# EasyEDA Pro project ProPrj_picoballoon-tracker-v2_2025-12-21.epro, board PCB5
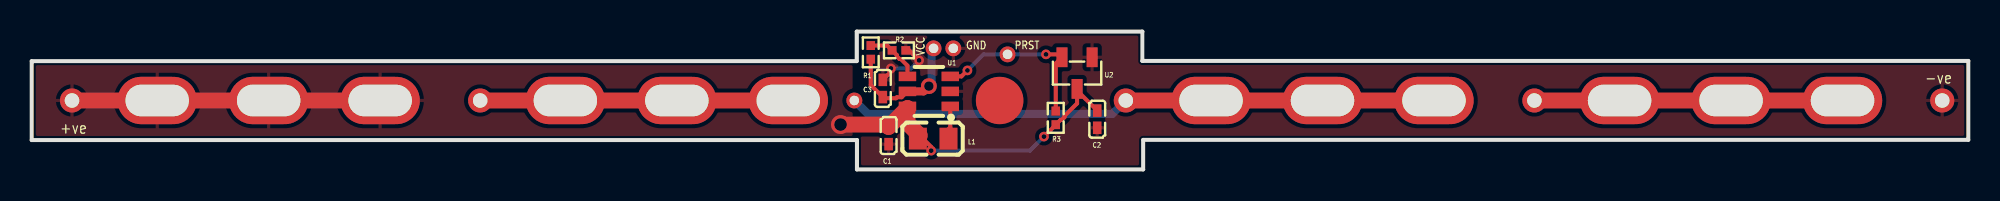
[diagram p5: board, top side]
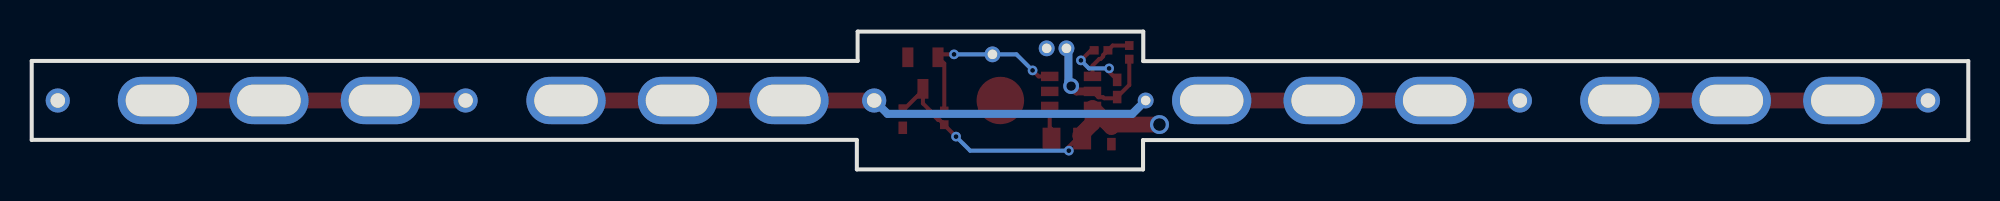
[diagram p6: board, bottom side, seen from below]

Outline 122.11 x 8.73 mm; copper layers: Top Layer, Bottom Layer. Coordinates in mm from the lower left corner of the outline.
Outline path: 0,6.86 52.02,6.86 52.02,8.73 70.03,8.73 70.03,6.87 122.11,6.87 122.11,1.87 70.08,1.87 70.08,0 52.04,0 52.04,1.86 0,1.86 0,6.86
Stack: Top Layer 0.035mm / Dielectric1 0.71mm FR4 er 4.5 / Bottom Layer 0.035mm

## Design rules (mm)
template: JLCPCB Capability(Two Layers Board)
spacing copperThickness1oz (default): track to track 0.102, other pairs 0.152 to 0.3
spacing copperThickness2oz: track to track 0.203, other pairs 0.152 to 0.3
track width copperThickness1oz (default): min 0.127, default 0.254, max 2.54
track width copperThickness2oz: min 0.203, default 0.254, max 2.54
differential pair differentialPair (default): width min 0.127, default 0.254, max 2.54; gap min 0.152, default 0.152
via viaSize (default): diameter min 0.5, default 0.61, max 10; hole min 0.3, default 0.305, max 6.3

## Placement (name value [footprint] x y rotation side)
C1  4.7uF  [C0402]  54.03 2.15 90 top
C2  100nF  [C0402]  67.19 3.18 270 top
C3  10uF  [C0402]  53.67 5.13 270 top
L1  4.7uH  [L0805]  56.84 1.95 0 top
NOREF  -  [Pad_e80]  7.91 4.36 0 top
NOREF#2  -  [Pad_e75]  94.75 4.36 0 top
NOREF#3  -  [Pad_e267]  58.11 7.67 0 top
NOREF#4  -  [Pad_e136]  61.53 7.28 0 top
NOREF#5  -  [Pad_e69]  68.99 4.36 0 top
NOREF#6  -  [Pad_e74]  114.19 4.36 0 top
NOREF#7  -  [Pad_e72]  100.13 4.36 0 top
NOREF#8  -  [Pad_e73]  107.16 4.36 0 top
NOREF#9  -  [Pad_e79]  2.54 4.36 0 top
NOREF#10  -  [Pad_e269]  56.87 7.67 0 top
NOREF#11  -  [Pad_e82]  21.97 4.36 0 top
NOREF#12  -  [Pad_e85]  40.68 4.36 0 top
NOREF#13  -  [Pad_e99]  120.47 4.36 0 top
NOREF#14  -  [Pad_e84]  33.65 4.36 0 top
NOREF#15  -  [Pad_e47]  88.42 4.36 0 top
NOREF#16  -  [Pad_e46]  81.39 4.36 0 top
NOREF#17  -  [Pad_e81]  14.94 4.36 0 top
NOREF#18  -  [Pad_e116]  61.03 4.36 0 top
NOREF#19  -  [Pad_e83]  28.28 4.36 0 top
NOREF#20  -  [Pad_e45]  74.36 4.36 0 top
NOREF#21  -  [Pad_e86]  47.71 4.36 0 top
NOREF#22  -  [Pad_e135]  51.87 4.36 0 top
R1  976kΩ  [R0402]  52.91 7.41 270 top
R2  562kΩ  [R0402]  54.68 7.54 180 top
R3  10kΩ  [R0402]  64.57 3.27 90 top
U1  MCP1640T-I/CHY  [SOT-23-6_L2.9-W1.6-P0.95-LS2.8-BR]  56.57 4.94 0 top
U2  APX803L20-23SA-7  [SOT-23-3_L2.9-W1.3-P1.90-LS2.4-BR]  65.92 6.1 90 top

## Footprints (pads in the part's own frame, mm; a bottom-side part is the same pattern mirrored in y, then rotated)
C0402
  rect 0.79x0.54 smd: 1(-0.545,0) 2(0.545,0)
L0805
  rect 1.133x1.377 smd: 1(-0.966,0) 2(0.966,0)
Pad_e45
  oval 5x3 hole 4x2: 1(0,0)
Pad_e46
  oval 5x3 hole 4x2: 1(0,0)
Pad_e47
  oval 5x3 hole 4x2: 1(0,0)
Pad_e69
  round 1.524 hole 0.914: 1(0,0)
Pad_e72
  oval 5x3 hole 4x2: 1(0,0)
Pad_e73
  oval 5x3 hole 4x2: 1(0,0)
Pad_e74
  oval 5x3 hole 4x2: 1(0,0)
Pad_e75
  round 1.524 hole 0.914: 1(0,0)
Pad_e79
  round 1.524 hole 0.914: 1(0,0)
Pad_e80
  oval 5x3 hole 4x2: 1(0,0)
Pad_e81
  oval 5x3 hole 4x2: 1(0,0)
Pad_e82
  oval 5x3 hole 4x2: 1(0,0)
Pad_e83
  round 1.524 hole 0.914: 1(0,0)
Pad_e84
  oval 5x3 hole 4x2: 1(0,0)
Pad_e85
  oval 5x3 hole 4x2: 1(0,0)
Pad_e86
  oval 5x3 hole 4x2: 1(0,0)
Pad_e99
  round 1.524 hole 0.914: 1(0,0)
Pad_e116
  round 3 smd: 1(0,0)
Pad_e135
  round 1 hole 0.6: 1(0,0)
Pad_e136
  round 1 hole 0.6: 1(0,0)
Pad_e267
  round 1 hole 0.6: 1(0,0)
Pad_e269
  round 1 hole 0.6: 1(0,0)
R0402
  rect 0.566x0.54 smd: 1(-0.433,0) 2(0.433,0)
SOT-23-3_L2.9-W1.3-P1.90-LS2.4-BR
  rect 1.25x0.7 smd: 1(1,-0.95) 2(1,0.95) 3(-1,0)
SOT-23-6_L2.9-W1.6-P0.95-LS2.8-BR
  rect 1.1x0.6 smd: 1(1.35,-0.95) 2(1.35,0) 3(1.35,0.95) 4(-1.35,0.95) 5(-1.35,0) 6(-1.35,-0.95)

## Nets
GND: C1.1 C2.2 C3.1 NOREF#3.1 NOREF#13.1 R2.1 U1.2 U2.1
VCC: C3.2 NOREF#10.1 R1.2 U1.5
VIN: C1.2 C2.1 L1.1 NOREF.1 NOREF#9.1 NOREF#11.1 NOREF#17.1 R3.1 U1.6 U2.3
PRST: NOREF#4.1 R3.2 U1.3 U2.2
$1N381: R1.1 R2.2 U1.4
$1N384: L1.2 U1.1

Pads without a net: NOREF#2 1; NOREF#5 1; NOREF#6 1; NOREF#7 1; NOREF#8 1; NOREF#12 1; NOREF#14 1; NOREF#15 1; NOREF#16 1; NOREF#18 1; NOREF#19 1; NOREF#20 1; NOREF#21 1; NOREF#22 1

## Via types
v1: diameter 0.61, hole 0.305, Top Layer to Bottom Layer, 6 vias
v2: diameter 1.2, hole 0.8, Top Layer to Bottom Layer, 1 via
v3: diameter 1, hole 0.6, Top Layer to Bottom Layer, 1 via

## Routing (per net, layer and track width the routed paths; a pad name or vN(x,y) marks a point on that pad's centre or on a via; arc(x,y) is an arc through that point)
GND: length 4
  Top Layer w0.254: R2.1 55.32,7.54 v1(55.95,6.9) ; v1(54.18,6.4) 54.18,6.18 C3.1
  Bottom Layer w0.254: v1(54.18,6.4) 55.45,6.4 v1(55.95,6.9)
VCC: length 8.5
  Top Layer w0.254: 52.91,6.98 52.91,5.34 C3.2 53.74,4.51 54.49,4.51 54.56,4.57 54.85,4.57 U1.5
  Top Layer w0.508: v3(56.57,5.27) 56.24,4.94 U1.5
  Bottom Layer w0.508: v3(56.57,5.27) 56.57,5.4 56.74,5.57 56.74,7.54 NOREF#10.1
VIN: length 40.7
  Top Layer w0.254: v1(63.83,2.08) 64.57,2.82 R3.1 64.88,3.14 64.96,3.14 65.12,3.3 65.12,3.38 65.92,4.18 65.92,4.99 ; C2.1 65.92,4.99 ; 65.92,4.99 U2.3 ; v1(56.72,1.19) 56.72,1.43 56,2.15
  Top Layer w1: 56,2.15 55.22,2.92 55.22,3.88 C1.2 53.88,2.84 v2(51,2.84) ; NOREF#9.1 NOREF.1 NOREF#17.1 NOREF#11.1
  Bottom Layer w0.254: v1(63.83,2.08) 62.94,1.19 v1(56.72,1.19)
(no net): length 76.1
  Top Layer w1: NOREF#5.1 NOREF#20.1 NOREF#16.1 NOREF#15.1 ; NOREF#21.1 NOREF#12.1 NOREF#14.1 NOREF#19.1 ; NOREF#6.1 NOREF#8.1 NOREF#7.1 NOREF#2.1
  Bottom Layer w0.508: NOREF#22.1 52.72,3.52 68.14,3.52 NOREF#5.1
PRST: length 11.3
  Top Layer w0.254: v1(59,6.27) 58.62,5.89 57.92,5.89 ; v1(63.96,7.28) 64.78,7.28 U2.2 64.57,6.71 R3.2
  Bottom Layer w0.254: v1(59,6.27) 60.02,7.28 NOREF#4.1 v1(63.96,7.28)
$1N381: length 3.6
  Top Layer w0.254: R1.1 53.95,7.84 R2.2 54.56,7.23 54.56,7.15 54.72,6.99 54.8,6.99 55.22,6.57 55.22,5.89
$1N384: length 2.1
  Top Layer w0.254: U1.1 57.92,2.67 57.4,2.15

## Copper pours and planes (outline as drawn; the poured copper is in the pictures)
GND on Top Layer: 52.02,8.72 52.02,0 70.04,0 70.08,0.05 70.08,1.86 122.11,1.86 122.11,6.87 70.03,6.87 70.03,8.73 52.03,8.73
VIN on Top Layer: 0,6.86 0,1.86 52.04,1.86 52.04,6.86

## Text on the board
Top Silkscreen Layer: VCC | GND | PRST | -ve | +ve
